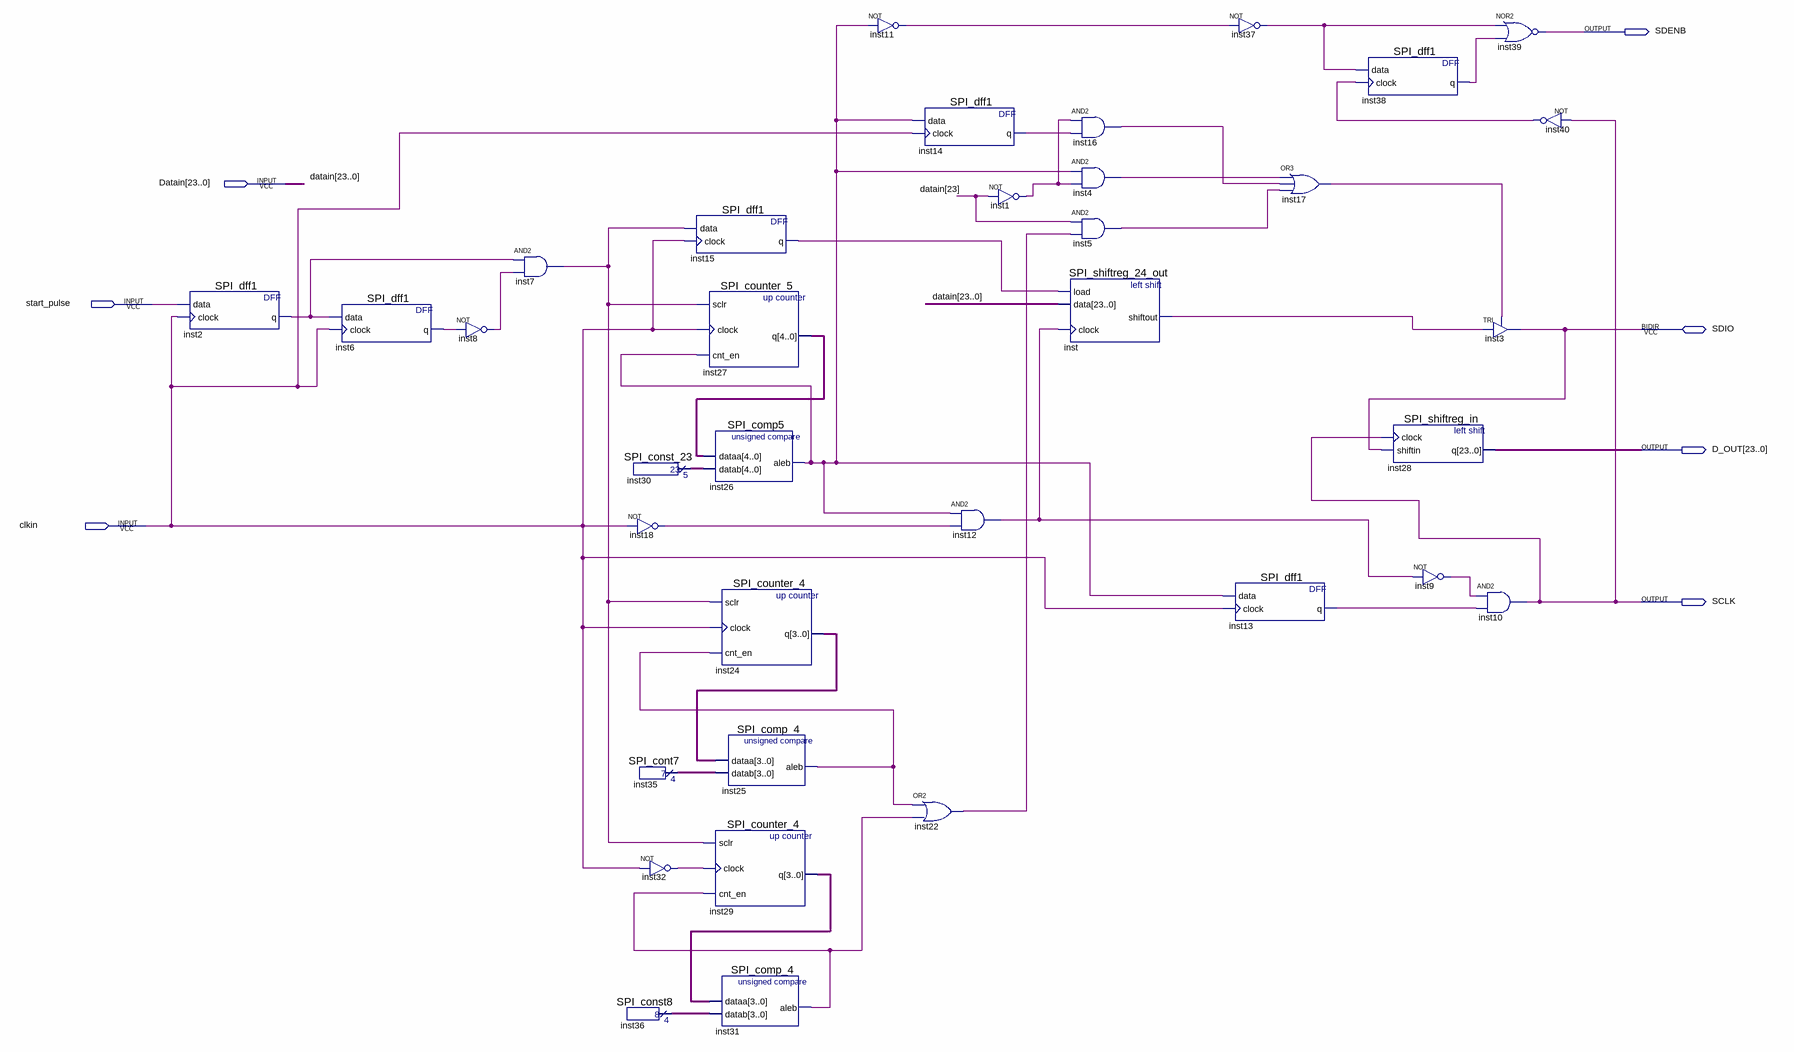
[diagram p0: schematic sheet]
// Quartus schematic SPI_Interface.bdf as structural Verilog: 35 symbols, 7 pins
module SPI_Interface (
  input  [23:0] Datain,
  input  start_pulse,
  input  clkin,
  inout  SDIO,
  output SDENB,
  output [23:0] D_OUT,
  output SCLK
);

  wire inst1_out, inst2_q, inst4_out, inst5_out, inst6_q, inst7_out, inst8_out, inst9_out, inst11_out,
       inst12_out, inst13_q, inst14_q, inst15_q, inst16_out, inst17_out, inst18_out, inst22_out, inst25_aleb,
       inst26_aleb, inst31_aleb, inst32_out, inst37_out, inst38_q, inst40_out, inst_shiftout;
  wire [3:0] inst24_q, inst29_q, inst35_result, inst36_result;
  wire [4:0] inst27_q, inst30_result;

  SPI_dff1 inst2 (.data(start_pulse), .clock(clkin), .q(inst2_q));
  SPI_dff1 inst6 (.data(inst2_q), .clock(clkin), .q(inst6_q));
  not inst8 (inst8_out, inst6_q);
  and inst7 (inst7_out, inst2_q, inst8_out);
  SPI_const8 inst36 (.result(inst36_result));
  SPI_const_23 inst30 (.result(inst30_result));
  not inst18 (inst18_out, clkin);
  SPI_cont7 inst35 (.result(inst35_result));
  not inst32 (inst32_out, clkin);
  SPI_dff1 inst15 (.data(inst7_out), .clock(clkin), .q(inst15_q));
  SPI_counter_5 inst27 (.sclr(inst7_out), .clock(clkin), .cnt_en(inst26_aleb), .q(inst27_q));
  SPI_comp5 inst26 (.dataa(inst27_q), .datab(inst30_result), .aleb(inst26_aleb));
  SPI_counter_4 inst24 (.sclr(inst7_out), .clock(clkin), .cnt_en(inst25_aleb), .q(inst24_q));
  SPI_comp_4 inst25 (.dataa(inst24_q), .datab(inst35_result), .aleb(inst25_aleb));
  SPI_counter_4 inst29 (.sclr(inst7_out), .clock(inst32_out), .cnt_en(inst31_aleb), .q(inst29_q));
  SPI_comp_4 inst31 (.dataa(inst29_q), .datab(inst36_result), .aleb(inst31_aleb));
  not inst11 (inst11_out, inst26_aleb);
  SPI_dff1 inst14 (.data(inst26_aleb), .clock(clkin), .q(inst14_q));
  or inst22 (inst22_out, inst25_aleb, inst31_aleb);
  and inst12 (inst12_out, inst26_aleb, inst18_out);
  not inst1 (inst1_out, Datain[23]);
  and inst16 (inst16_out, inst1_out, inst14_q);
  and inst4 (inst4_out, inst26_aleb, inst1_out);
  and inst5 (inst5_out, Datain[23], inst22_out);
  SPI_shiftreg_24_out inst (.load(inst15_q), .data(Datain), .clock(inst12_out), .shiftout(inst_shiftout));
  SPI_dff1 inst13 (.data(inst26_aleb), .clock(clkin), .q(inst13_q));
  not inst37 (inst37_out, inst11_out);
  or inst17 (inst17_out, inst4_out, inst16_out, inst5_out);
  SPI_dff1 inst38 (.data(inst37_out), .clock(inst40_out), .q(inst38_q));
  SPI_shiftreg_in inst28 (.clock(SCLK), .shiftin(SDIO), .q(D_OUT));
  not inst9 (inst9_out, inst12_out);
  and inst10 (SCLK, inst9_out, inst13_q);
  nor inst39 (SDENB, inst37_out, inst38_q);
  TRI inst3 (.IN(inst_shiftout), .OE(inst17_out), .OUT(SDIO));
  not inst40 (inst40_out, SCLK);
endmodule
